# Altium schematic sheet TELM0002ADC.SchDoc: MAX127 Telemetry Circuit
size A3; Engineer: A. SHAW; Organization: BLUEsat Project; Address1: Room 419; Address2: School of EE&T; Address3: UNSW, NSW 2052; Address4: Australia; DocumentNumber: TELM0002; SheetNumber: 1; SheetTotal: 1; Version: 1.0
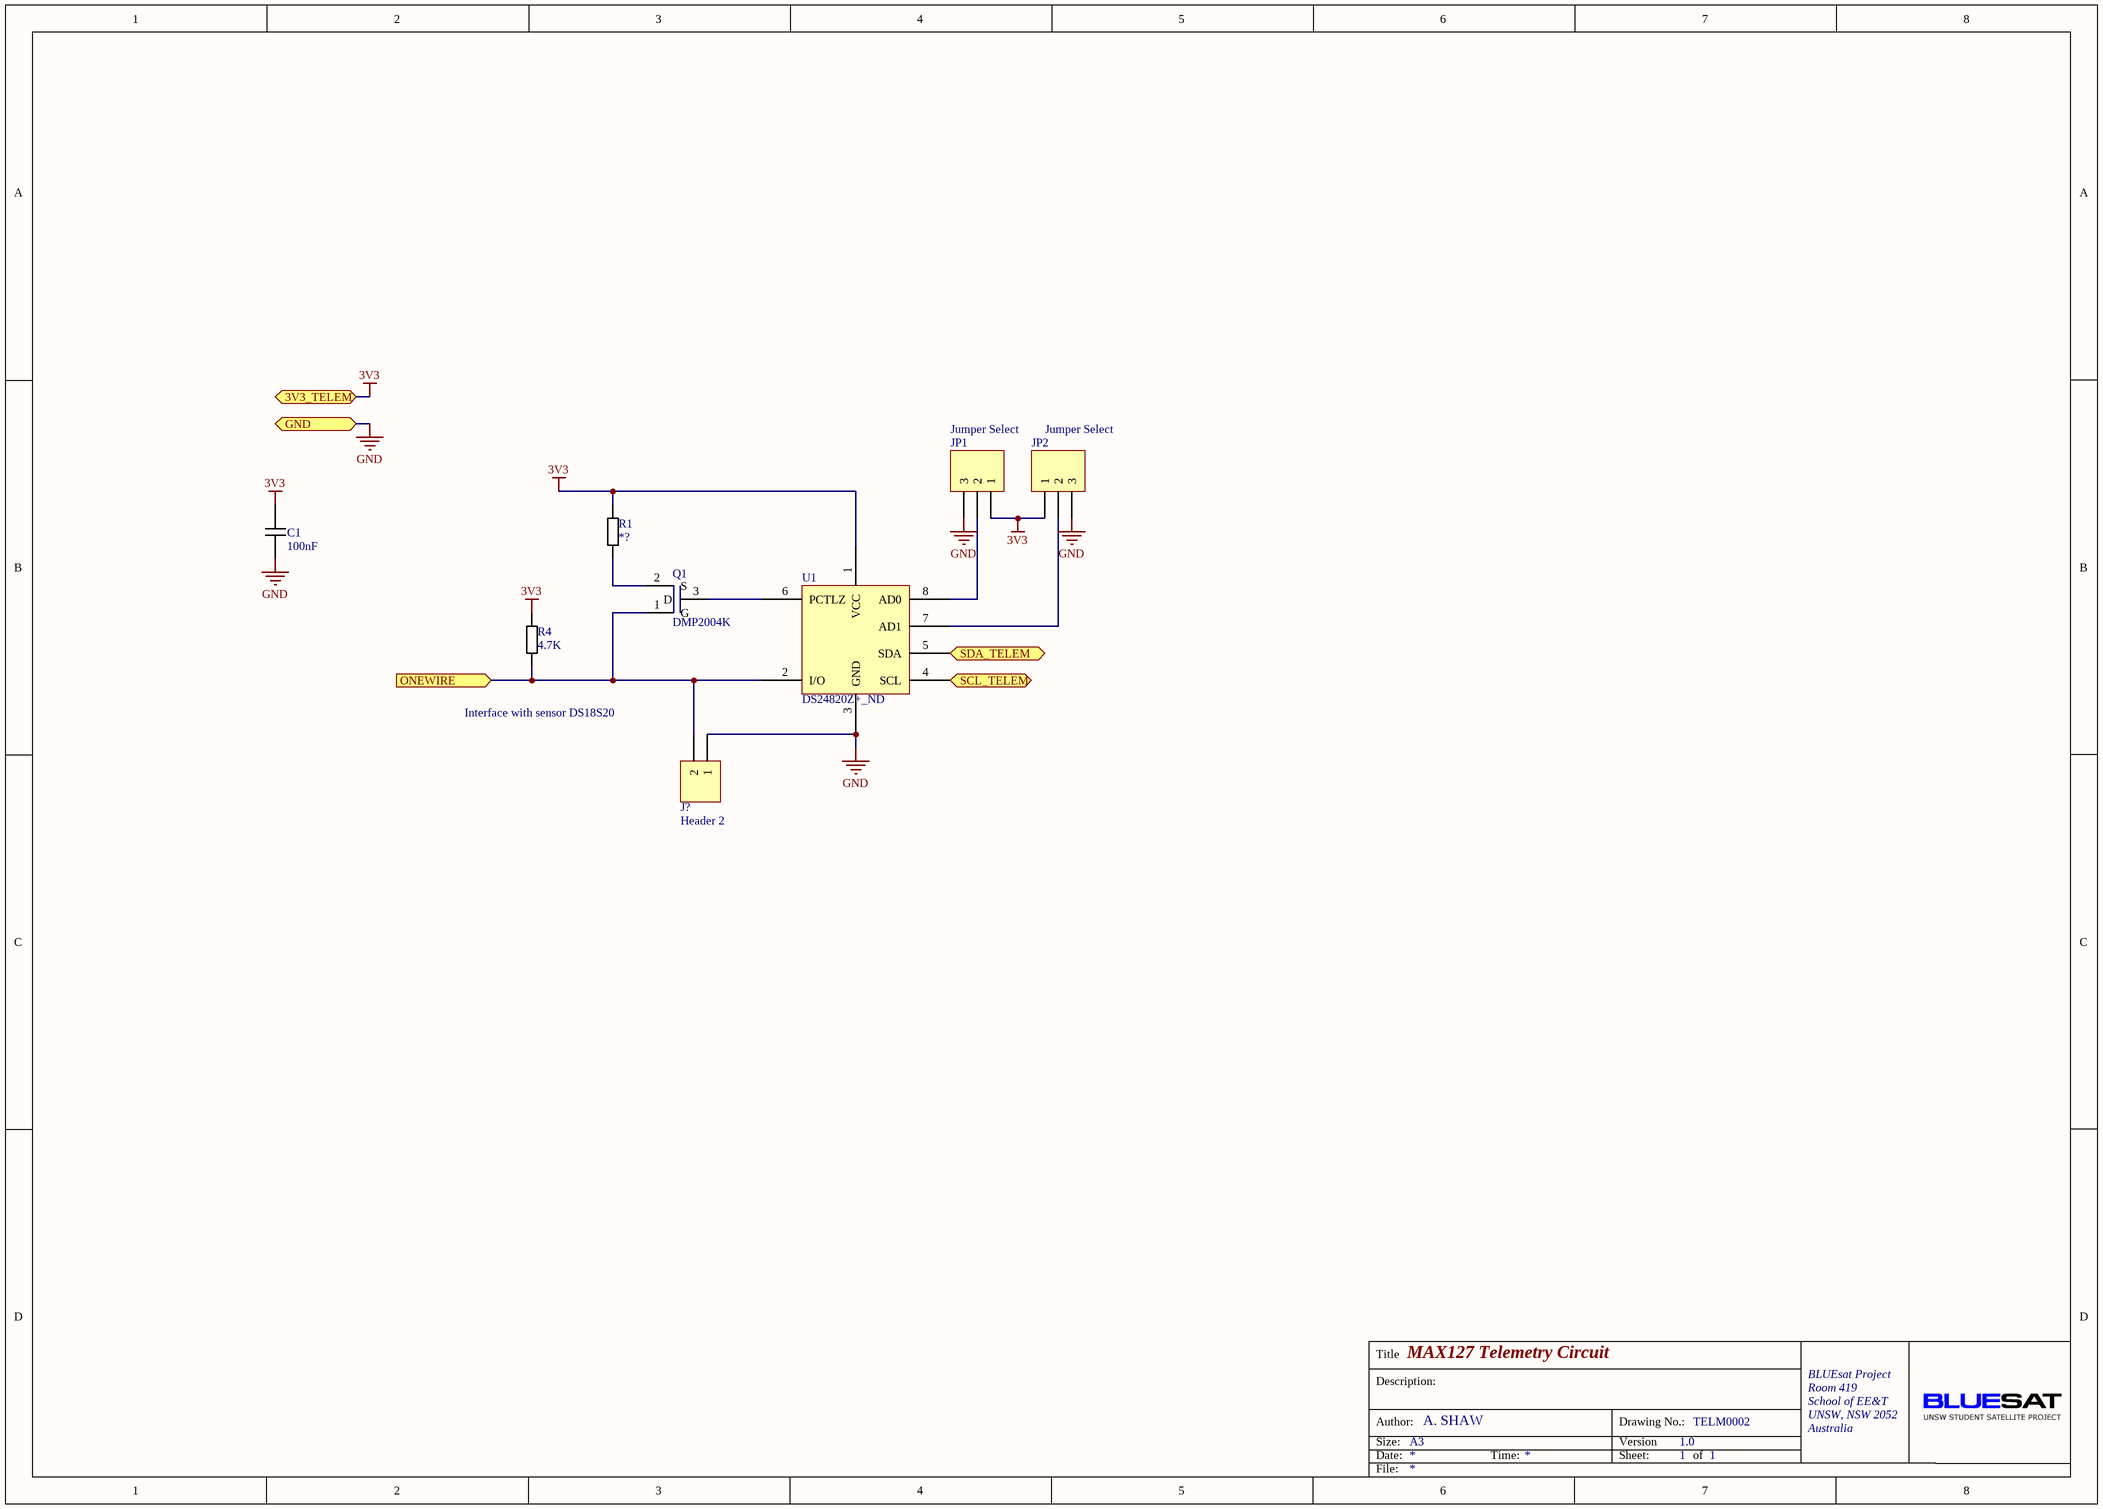
[diagram p0: TELM0002ADC.SchDoc]

## Parts
C1  value 100nF  [0805 Cap]  (hidden comment: 0805 Cap)
J?  Header 2  [HDR1X2]
JP1  Jumper Select  [SOLDER_JUMPER_3_A]
JP2  Jumper Select  [SOLDER_JUMPER_3_A]
Q1  DMP2004K  [DMP2004KDITR-ND]
R1  value *?  [0805 Resistor]  (hidden comment: 0805 Resistor)
R4  value 4.7K  [0805 Resistor]  (hidden comment: 0603 Resistor)
U1  DS24820Z+_ND  [DS2482-100]

## Ports
3V3_TELEM, GND, ONEWIRE (in), SCL_TELEM (in), SDA_TELEM (bidir)

## Nets
3V3: C1.2 JP1.1 JP2.1 R1.2 R4.2 U1.1(VCC) ; port 3V3_TELEM
GND: C1.1 J?.1 JP1.3 JP2.3 U1.3(GND) ; port GND
ONEWIRE: J?.2 Q1.1(G) R4.1 U1.2(I/O) ; port ONEWIRE
SCL_TELEM: U1.4(SCL) ; port SCL_TELEM
SDA_TELEM: U1.5(SDA) ; port SDA_TELEM
NetJP1_2: JP1.2 U1.8(AD0)
NetJP2_2: JP2.2 U1.7(AD1)
NetQ1_2: Q1.2(S) R1.1
NetQ1_3: Q1.3(D) U1.6(PCTLZ)

## Notes on the sheet
- Interface with sensor DS18S20
- Title
- Description:
- Size:
- Author:
- Date:
- A3
- Time:
- Version
- Sheet:
- Drawing No.:
- of
- File:

## Library data of the parts
C1 = 0805 MLCC - X7R, 10%
J? = Header 2: Header, 2-Pin; LatestRevisionDate: 17-Jul-2002; LatestRevisionNote: Re-released for DXP Platform.; Publisher: Altium Limited
JP1 JP2 = Header 3: Header, 3-Pin; LatestRevisionDate: 17-Jul-2002; LatestRevisionNote: Re-released for DXP Platform.; Publisher: Altium Limited
Q1 = DMP2004K: MOSFET P-CH 20V 600MA SOT23-3
R1 = 0805 Thick Film Resistor 1%
R4 = 0603 Thick Film Resistor 1%